# Altium schematic sheet SCC1002_KEYBOARD_DISPLAY.SchDoc
size A4; DrawnBy: Marco
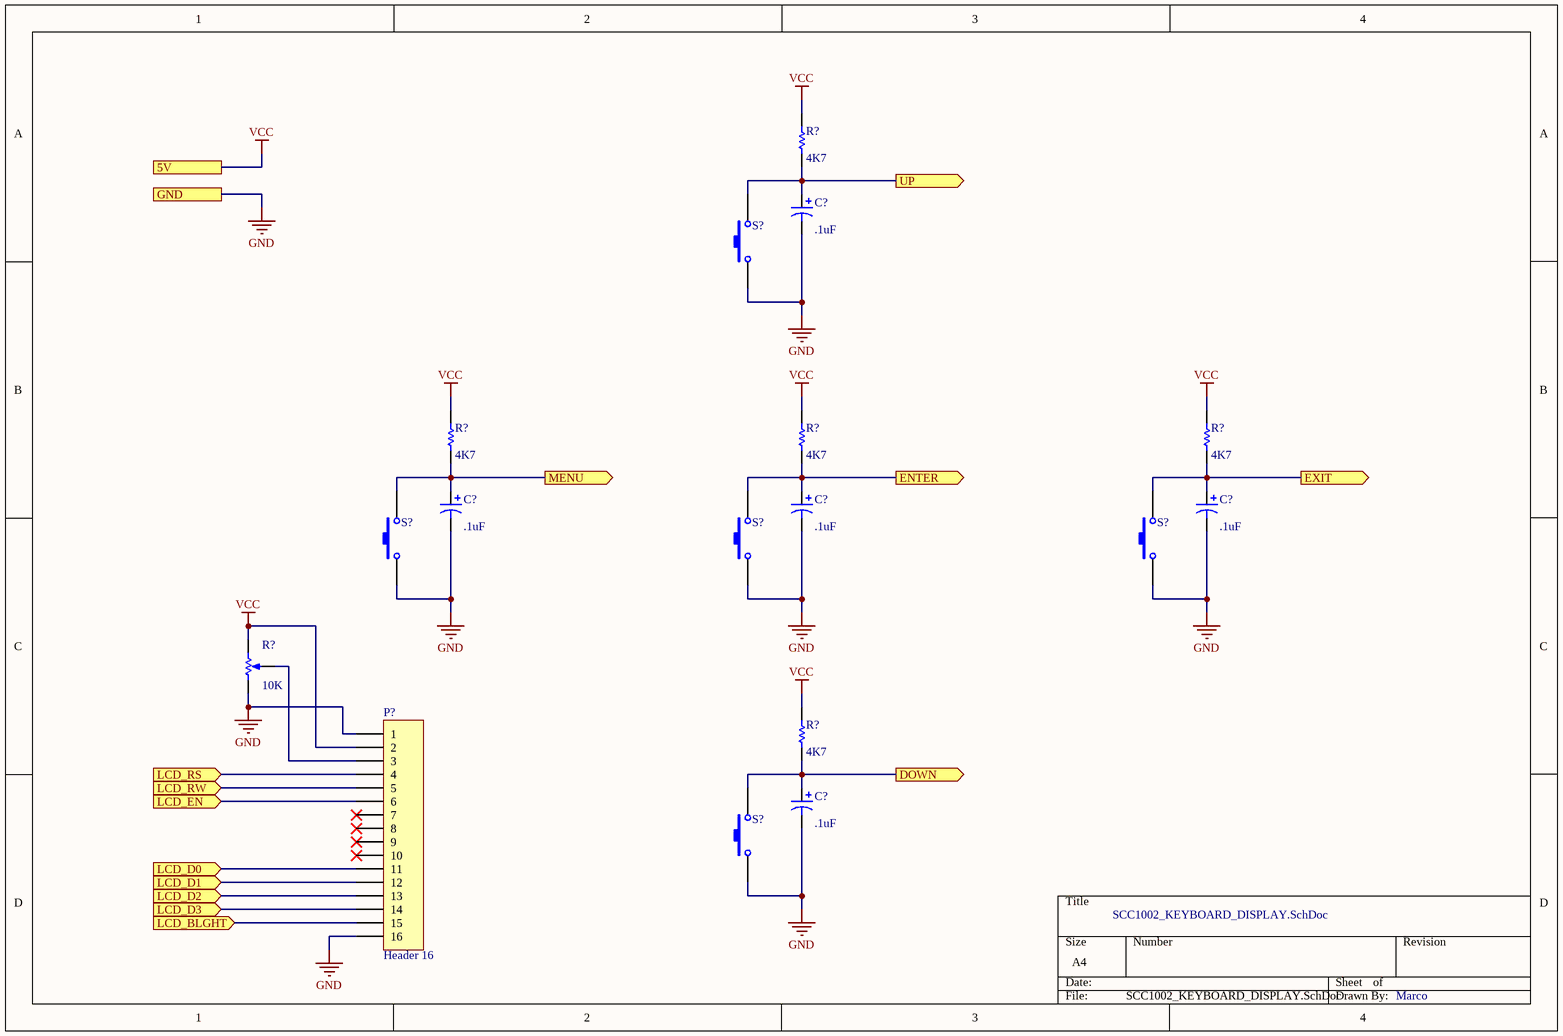
[diagram p0: SCC1002_KEYBOARD_DISPLAY.SchDoc]

## Parts
(Parts that share a designator on the sheet are numbered #1, #2 ... from top to bottom, then left to right.)
C?#1  value .1uF  [RB7.6-15]  (hidden comment: Cap Pol1)
C?#2  value .1uF  [RB7.6-15]  (hidden comment: Cap Pol1)
C?#3  value .1uF  [RB7.6-15]  (hidden comment: Cap Pol1)
C?#4  value .1uF  [RB7.6-15]  (hidden comment: Cap Pol1)
C?#5  value .1uF  [RB7.6-15]  (hidden comment: Cap Pol1)
P?  Header 16  [HDR1X16]
R?#1  value 4K7  [AXIAL-0.3]  (hidden comment: Res1)
R?#2  value 4K7  [AXIAL-0.3]  (hidden comment: Res1)
R?#3  value 4K7  [AXIAL-0.3]  (hidden comment: Res1)
R?#4  value 4K7  [AXIAL-0.3]  (hidden comment: Res1)
R?#5  value 10K  [VR5]  (hidden comment: RPot)
R?#6  value 4K7  [AXIAL-0.3]  (hidden comment: Res1)
S?#1  SW-PB  [SPST-2]  (value not drawn)
S?#2  SW-PB  [SPST-2]  (value not drawn)
S?#3  SW-PB  [SPST-2]  (value not drawn)
S?#4  SW-PB  [SPST-2]  (value not drawn)
S?#5  SW-PB  [SPST-2]  (value not drawn)

## Ports
5V, DOWN (out), ENTER (out), EXIT (out), GND, LCD_BLGHT (in), LCD_D0 (in), LCD_D1 (in), LCD_D2 (in), LCD_D3 (in), LCD_EN (in), LCD_RS (in), LCD_RW (in), MENU (out), UP (out)

## Nets
GND: C?#1.2 C?#2.2 C?#3.2 C?#4.2 C?#5.2 P?.1 P?.16 R?#5.1(TOP) S?#1.1 S?#2.1 S?#3.1 S?#4.1 S?#5.1 ; port GND
VCC: P?.2 R?#1.2 R?#2.2 R?#3.2 R?#4.2 R?#5.2(BOT) R?#6.2 ; port 5V
DOWN: C?#5.1 R?#6.1 S?#5.2 ; port DOWN
ENTER: C?#3.1 R?#3.1 S?#3.2 ; port ENTER
EXIT: C?#4.1 R?#4.1 S?#4.2 ; port EXIT
LCD_BLGHT: P?.15 ; port LCD_BLGHT
LCD_D0: P?.11 ; port LCD_D0
LCD_D1: P?.12 ; port LCD_D1
LCD_D2: P?.13 ; port LCD_D2
LCD_D3: P?.14 ; port LCD_D3
LCD_EN: P?.6 ; port LCD_EN
LCD_RS: P?.4 ; port LCD_RS
LCD_RW: P?.5 ; port LCD_RW
MENU: C?#2.1 R?#2.1 S?#2.2 ; port MENU
UP: C?#1.1 R?#1.1 S?#1.2 ; port UP
NetP?_3: P?.3 R?#5.3(TAP)

Not connected (* = marked no-connect by the designer): P? 7* 8* 9* 10*

## Library data of the parts
C?#1-C?#5 = Cap Pol1: Polarized Capacitor (Radial); Published: 8-Jun-2000; LatestRevisionDate: 17-Jul-2002; LatestRevisionNote: Re-released for DXP Platform.; PackageReference: RB7.6-15; Publisher: Altium Limited; PackageDescription: Polarized Capacitor (Radial); 2 Leads
P? = Header 16: Header, 16-Pin; LatestRevisionDate: 17-Jul-2002; LatestRevisionNote: Re-released for DXP Platform.; Publisher: Altium Limited
R?#1-R?#4 R?#6 = Res1: Resistor; Published: 8-Jun-2000; LatestRevisionDate: 17-Jul-2002; LatestRevisionNote: Re-released for DXP Platform.; PackageReference: AXIAL-0.3; Publisher: Altium Limited; PackageDescription: Axial Device, Thru-Hole; 2 Leads; 0.3 in Pin Spacing
R?#5 = RPot: Potentiometer; Sim Note: Enter the Resistance value and the set point into parameter fields.; Set Position: 0.5; Published: 8-Jun-2000; LatestRevisionDate: 17-Jul-2002; LatestRevisionNote: Re-released for DXP Platform.; PackageReference: VR5; Publisher: Altium Limited; PackageDescription: Variable Resistor, Thru-Hole; 3 Leads
S?#1-S?#5 = SW-PB: Switch; Published: 24-Mar-1999; LatestRevisionDate: 17-Jul-2002; LatestRevisionNote: Re-released for DXP Platform.; PackageReference: SPST-2; Publisher: Altium Limited; PackageDescription: Switch; 2 Leads